# EAGLE design prototipo final 2.1 (EAGLE 6.5.0)
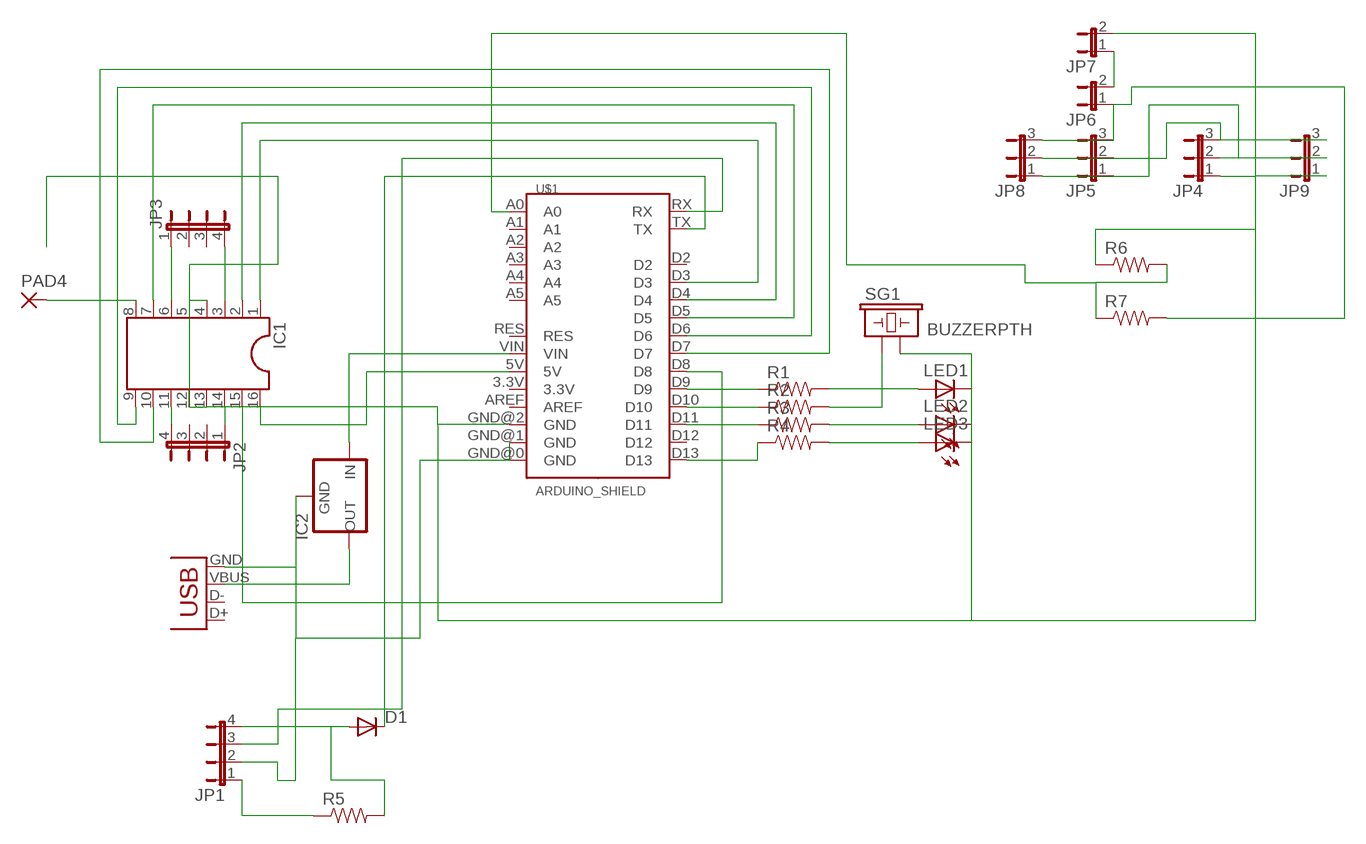
[diagram p0: schematic, sheet 1]

## Parts
D1  DIODEPTH  [DIODE-1N4001]
IC1  DIL16S  [SOCKET-16]
IC2  V_REG_78XXSINK  [TO220-IGO]
JP1  JP4E  [JP4]
JP2  JP4E  [JP4]
JP3  JP4E  [JP4]
JP4  JP2E  [JP2]
JP5  JP2E  [JP2]
JP6  JP1E  [JP1]
JP7  JP1E  [JP1]
JP8  JP2E  [JP2]
JP9  JP2E  [JP2]
LED1  LED3MM  [LED3MM]
LED2  LED3MM  [LED3MM]
LED3  LED3MM  [LED3MM]
PAD4  2,15/1,0  [2,15/1,0]
R1  RESISTORPTH1  [AXIAL-0.3]
R2  RESISTORPTH1  [AXIAL-0.3]
R3  RESISTORPTH1  [AXIAL-0.3]
R4  RESISTORPTH1  [AXIAL-0.3]
R5  RESISTORPTH1  [AXIAL-0.3]
R6  RESISTORPTH1  [AXIAL-0.3]
R7  RESISTORPTH1  [AXIAL-0.3]
SG1  BUZZERPTH  [BUZZER-12MM]
U$1  ARDUINO_SHIELD  [DUEMILANOVE_SHIELD]
X1  USB-A-S  [USB-A-S]

## Nets
N$1: IC1.1 U$1.D3
N$2: IC1.2 U$1.D4
N$3: IC1.6 JP3.1
N$4: IC1.3 JP3.4
N$5: IC1.11 JP2.4
N$6: IC1.14 JP2.1
N$7: IC1.16 U$1.5V
N$8: JP5.3 JP6.1 JP8.3 R7.P$2
N$9: IC2.OUT X1.VBUS
N$12: IC1.8 PAD4.1(P)
N$13: IC1.7 U$1.D5
N$14: R4.P$1 U$1.D13
N$15: IC1.9 U$1.D6
N$16: IC1.10 U$1.D7
N$17: IC2.GND JP1.2 U$1.GND@0(GND) U$1.GND@1(GND) X1.GND
N$18: IC1.15 U$1.D8
N$20: R1.P$1 U$1.D9
N$21: R2.P$1 U$1.D10
N$22: R3.P$1 U$1.D11
N$23: IC1.4 IC1.5 IC1.12 IC1.13 JP4.1 JP7.2 JP9.1 LED1.K(C) LED2.K(C) LED3.K(C) R6.P$1 SG1.- U$1.GND@2(GND)
N$24: LED3.A R4.P$2
N$25: LED2.A R3.P$2
N$26: LED1.A R1.P$2
N$27: JP4.2 JP5.1 JP8.1 JP9.2
N$28: JP1.1 R5.P$1
N$29: JP4.3 JP5.2 JP8.2 JP9.3
N$30: R2.P$2 SG1.+
N$31: JP6.2 JP7.1
N$33: R6.P$2 R7.P$1 U$1.A0
N$34: D1.C U$1.TX
N$35: D1.A JP1.4 R5.P$2
N$36: JP1.3 U$1.RX
N$38: IC2.IN U$1.VIN
Unconnected: JP2.2 JP2.3 JP3.2 JP3.3 U$1.3.3V U$1.A1 U$1.A2 U$1.A3 U$1.A4 U$1.A5 U$1.AREF U$1.D2 U$1.D12 U$1.RES X1.D+ X1.D-

## Library data of the parts
D1 = SparkFun:DIODE: Diode These are standard reverse protection diodes and small signal diodes. SMA package can handle up to about 1A. SOD-323 can handle about 200mA. What the SOD-323 package when ordering, there are some mfgs out there that are 5-pin packages.
IC1 = ic-package:DIL16: Dual In Line / Socket
IC2 = SparkFun:V_REG_78XX: Voltage Regulator Standard 7805 5V regulator. IGO (Input Ground Output). Spark Fun Electronics SKU : COM-00107
JP1-JP3 = jumper:JP4E: JUMPER
JP4 JP5 JP8 JP9 = jumper:JP2E: JUMPER
JP6 JP7 = jumper:JP1E: JUMPER
LED1-LED3 = SparkFun:LED: LEDs Standard schematic elements and footprints for 5mm, 3mm, 1206, and 0603 sized LEDs. 5mm - Spark Fun Electronics SKU : COM-00529 (and others)
PAD4 = wirepad:2,15/1,0: THROUGH-HOLE PAD
R1-R7 = SparkFun:RESISTOR: Resistor Basic schematic elements and footprints for 0603, 1206, and PTH 1/10th watt (small) resistors.
SG1 = SparkFun:BUZZER: Buzzer 12mm Spark Fun Electronics SKU : Comp-Buzzer
U$1 = SparkFun:ARDUINO_SHIELD
X1 = SparkFun:USB: USB Connectors USB-B-PTH is fully proven SKU : PRT-00139 USB-miniB is fully proven SKU : PRT-00587 USB-A-PCB is untested. USB-A-H is throughly reviewed, but untested. Spark Fun Electronics SKU : PRT-00437 USB-B-SMT is throughly reviewed, but untested. Needs silkscreen touching up. USB-A-S has not been used/tested USB-MB-H has not been used/tested

## Board
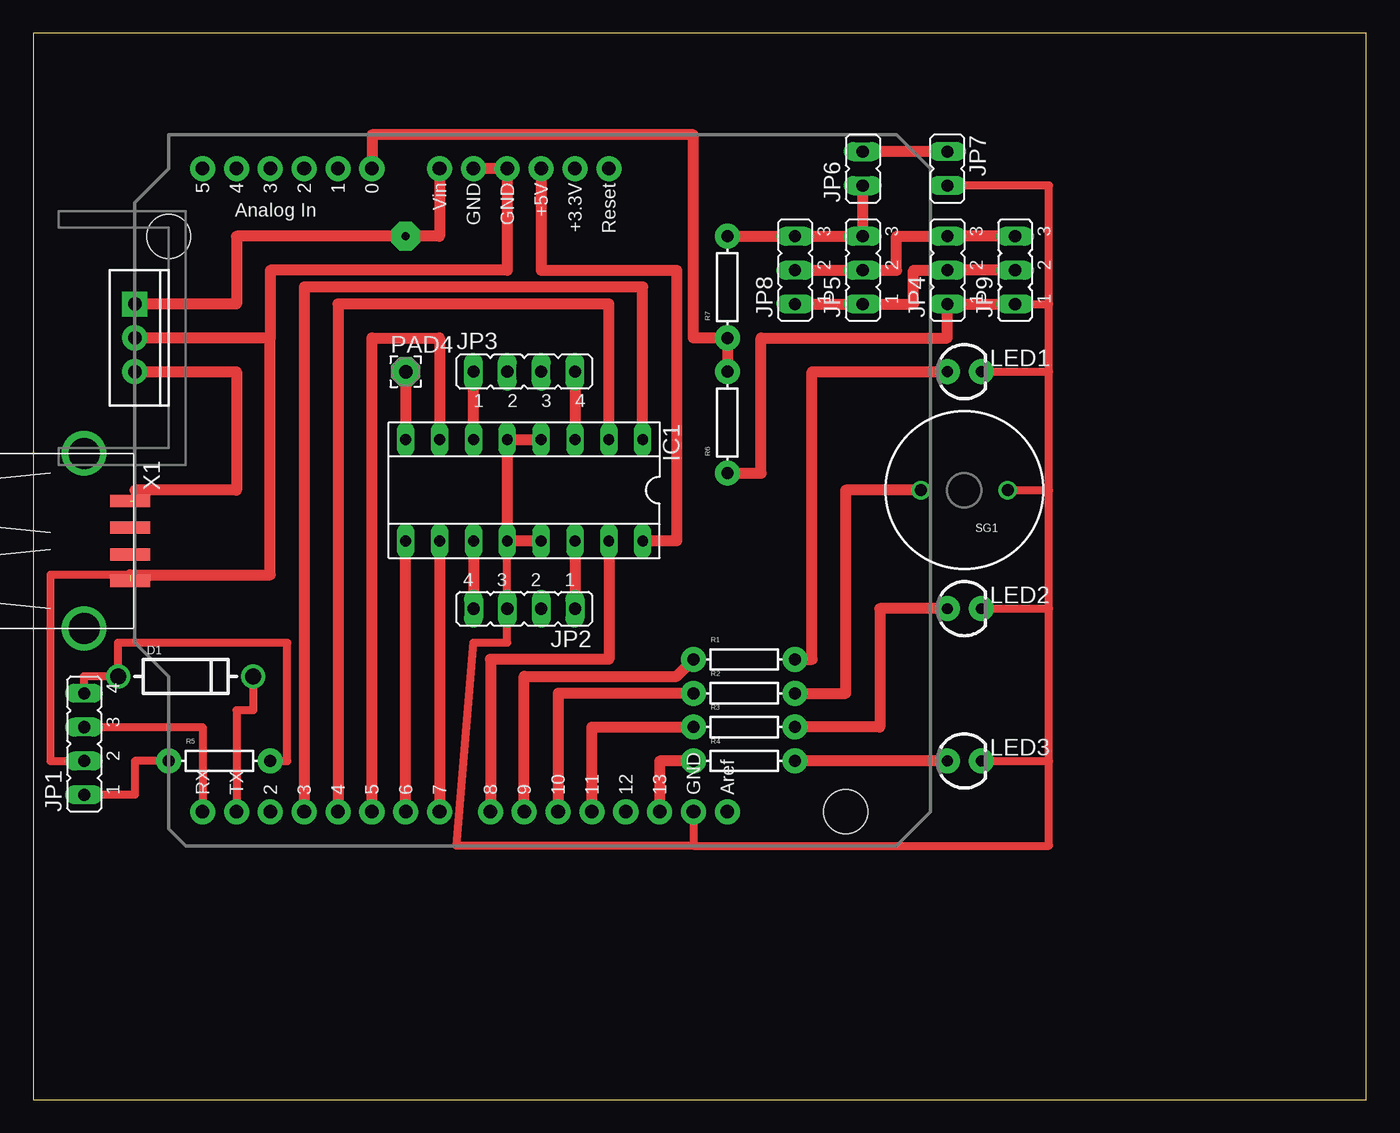
[diagram p1: board, top side]

Size 100 x 80 mm. Coordinates in mm from the lower left corner, seen from the top.
Outline: 0,0 100,0 100,80 0,80 0,0
Copper layers (1*16): Top 0.035mm / dielectric 1.5mm / Bottom 0.035mm
Design rules "default": minimum track width 10mil, minimum drill 24mil, track to track 8mil, track to pad 8mil, pad to pad 8mil, via to via 8mil, smd to smd 8mil, copper to edge 40mil, drill to drill 8mil, minimum pad ring 10mil, minimum via ring 8mil, stop-mask expansion 4mil, vias tented up to drill 0mil, thermal gap 10mil

### Footprints (pad centres in the part's own frame; a part is rotated, then mirrored left to right if it is on the bottom)
DIODE-1N4001 = drill 1.2: A -5.08,0; C 5.08,0
SOCKET-16 = drill 0.813 long: 1 -8.89,-3.81; 2 -6.35,-3.81; 3 -3.81,-3.81; 4 -1.27,-3.81; 5 1.27,-3.81; 6 3.81,-3.81; 7 6.35,-3.81; 8 8.89,-3.81; 9 8.89,3.81; 10 6.35,3.81; 11 3.81,3.81; 12 1.27,3.81; 13 -1.27,3.81; 14 -3.81,3.81; 15 -6.35,3.81; 16 -8.89,3.81
TO220-IGO = drill 1 pad 1.88: GND 0,0; OUT 2.54,0 | drill 1 pad 1.88 square: IN -2.54,0
JP4 = drill 0.914 long: 1 -3.81,0; 2 -1.27,0; 3 1.27,0; 4 3.81,0
JP2 = drill 0.914 long: 1 -2.54,0; 2 0,0; 3 2.54,0
JP1 = drill 0.914 long: 1 0,-1.27; 2 0,1.27
LED3MM = drill 0.813 pad 1.88: A -1.27,0; K 1.27,0
2,15/1,0 = drill 1.016 pad 2.159 octagon: 1 0,0
AXIAL-0.3 = drill 0.9 pad 1.88: P$1 -3.81,0; P$2 3.81,0
BUZZER-12MM = drill 0.9: + 3.25,0; - -3.25,0
DUEMILANOVE_SHIELD = drill 1.016 pad 1.88: 3.3V 50.8,26.67; 5V 50.8,29.21; A0 50.8,41.91; A1 50.8,44.45; A2 50.8,46.99; A3 50.8,49.53; A4 50.8,52.07; A5 50.8,54.61; AREF 2.54,15.24; D2 2.54,49.53; D3 2.54,46.99; D4 2.54,44.45; D5 2.54,41.91; D6 2.54,39.37; D7 2.54,36.83; D8 2.54,33.02; D9 2.54,30.48; D10 2.54,27.94; D11 2.54,25.4; D12 2.54,22.86; D13 2.54,20.32; GND@0 50.8,31.75; GND@1 50.8,34.29; GND@2 2.54,17.78; RES 50.8,24.13; RX 2.54,54.61; TX 2.54,52.07; VIN 50.8,36.83 | hole 3.302: 45.72,57.15; 2.54,6.35
USB-A-S = smd 3 x 0.9: D+ 3.45,-1; D- 3.45,1; GND 3.45,-3; VBUS 3.45,3 | drill 2.311: P$5 0,-6.566; P$6 0,6.566

### Placement (x,y rotation side)
D1  11.43,31.75 0 top
IC1  36.83,45.72 180 top
IC2  7.62,57.15 270 top
JP1  3.81,26.67 90 top
JP2  36.83,36.83 180 top
JP3  36.83,54.61 0 top
JP4  68.58,62.23 90 top
JP5  62.23,62.23 90 top
JP6  62.23,69.85 0 top
JP7  68.58,69.85 180 top
JP8  57.15,62.23 90 top
JP9  73.66,62.23 90 top
LED1  69.85,54.61 0 top
LED2  69.85,36.83 0 top
LED3  69.85,25.4 0 top
PAD4  27.94,54.61 0 top
R1  53.34,33.02 0 top
R2  53.34,30.48 0 top
R3  53.34,27.94 0 top
R4  53.34,25.4 0 top
R5  13.97,25.4 0 top
R6  52.07,50.8 90 top
R7  52.07,60.96 90 top
SG1  69.85,45.72 180 top
U$1  67.31,19.05 90 top
X1  3.81,41.91 0 top

### Tracks (layer width: path | path; a pad name or v marks a point on that pad's centre or on a via)
N$1
  Top 0.813: IC1.1 45.72,60.96 20.32,60.96 U$1.D3
N$2
  Top 0.813: IC1.2 43.18,59.69 22.86,59.69 U$1.D4
N$3
  Top 0.813: IC1.6 JP3.1
N$4
  Top 0.813: JP3.4 IC1.3
N$5
  Top 0.813: IC1.11 JP2.4
N$6
  Top 0.813: IC1.14 JP2.1
N$7
  Top 0.813: U$1.5V 38.1,62.23 48.26,62.23 48.26,41.91 IC1.16
N$8
  Top 0.813: JP6.1 JP5.3 JP8.3 R7.P$2
N$9  (1 unrouted)
  Top 0.61: 7.62,45.72 7.62,44.91
  Top 0.813: IC2.OUT 15.24,54.61 15.24,45.72 7.62,45.72
N$10  (via drill 0.6 pad 2.54)
  other vias: 3.81,48.26
N$11  (via drill 0.6 pad 2.54)
  other vias: 3.81,35.56
N$12
  Top 0.813: PAD4.1 IC1.8
N$13
  Top 0.813: U$1.D5 25.4,57.15 30.48,57.15 IC1.7
N$14
  Top 0.813: R4.P$1 46.99,25.4 U$1.D13
N$15
  Top 0.813: U$1.D6 IC1.9
N$16
  Top 0.813: IC1.10 U$1.D7
N$17  (1 unrouted)
  Top 0.61: 7.26,39.37 1.27,39.37 1.27,25.4 JP1.2
  Top 0.813: U$1.GND@1 U$1.GND@0 35.56,62.23 17.78,62.23 17.78,57.15 | 17.78,57.15 IC2.GND | 7.26,39.37 17.78,39.37 17.78,57.15
N$18
  Top 0.813: IC1.15 43.18,33.02 34.29,33.02 U$1.D8
N$20
  Top 0.813: U$1.D9 36.83,31.75 48.26,31.75 R1.P$1
N$21
  Top 0.813: R2.P$1 39.37,30.48 U$1.D10
N$22
  Top 0.813: U$1.D11 41.91,27.94 R3.P$1
N$23
  Top 0.61: IC1.12 35.56,34.29 33.02,34.29 31.75,19.05 49.53,19.05 | U$1.GND@2 49.53,19.05 | 49.53,19.05 76.2,19.05 76.2,25.4 | LED1.K 76.2,54.61 | JP9.1 76.2,59.69 | 76.2,59.69 76.2,68.58 JP7.2 | 76.2,54.61 76.2,59.69 | SG1.- 76.2,45.72 | 76.2,45.72 76.2,54.61 | LED2.K 76.2,36.83 | 76.2,36.83 76.2,45.72 | LED3.K 76.2,25.4 | 76.2,25.4 76.2,36.83
  Top 0.813: IC1.4 IC1.5 IC1.12 IC1.13 | JP9.1 JP4.1 68.58,57.15 54.61,57.15 54.61,46.99 R6.P$1
N$24
  Top 0.813: LED3.A R4.P$2
N$25
  Top 0.813: LED2.A 63.5,36.83 63.5,27.94 R3.P$2
N$26
  Top 0.813: R1.P$2 58.42,33.02 58.42,54.61 LED1.A
N$27
  Top 0.813: JP9.2 JP4.2 66.04,62.23 66.04,59.69 JP5.1 JP8.1
N$28
  Top 0.61: R5.P$1 7.62,25.4 7.62,22.86 JP1.1
N$29
  Top 0.813: JP9.3 JP4.3 64.77,64.77 64.77,62.23 JP5.2 JP8.2
N$30
  Top 0.813: SG1.+ 60.96,45.72 60.96,30.48 R2.P$2
N$31
  Top 0.813: JP7.1 JP6.2
N$33
  Top 0.813: R6.P$2 R7.P$1 49.53,57.15 49.53,66.04 49.53,72.39 25.4,72.39 U$1.A0
N$34
  Top 0.61: U$1.TX 15.24,29.21 16.51,29.21 D1.C
N$35
  Top 0.61: JP1.4 3.81,31.75 D1.A 6.35,34.29 19.05,34.29 19.05,25.4 R5.P$2
N$36
  Top 0.61: U$1.RX 12.7,27.94 JP1.3
N$38  (via drill 0.6 pad 2.18)
  Top 0.813: U$1.VIN 30.48,64.77 v27.94,64.77 15.24,64.77 15.24,59.69 IC2.IN